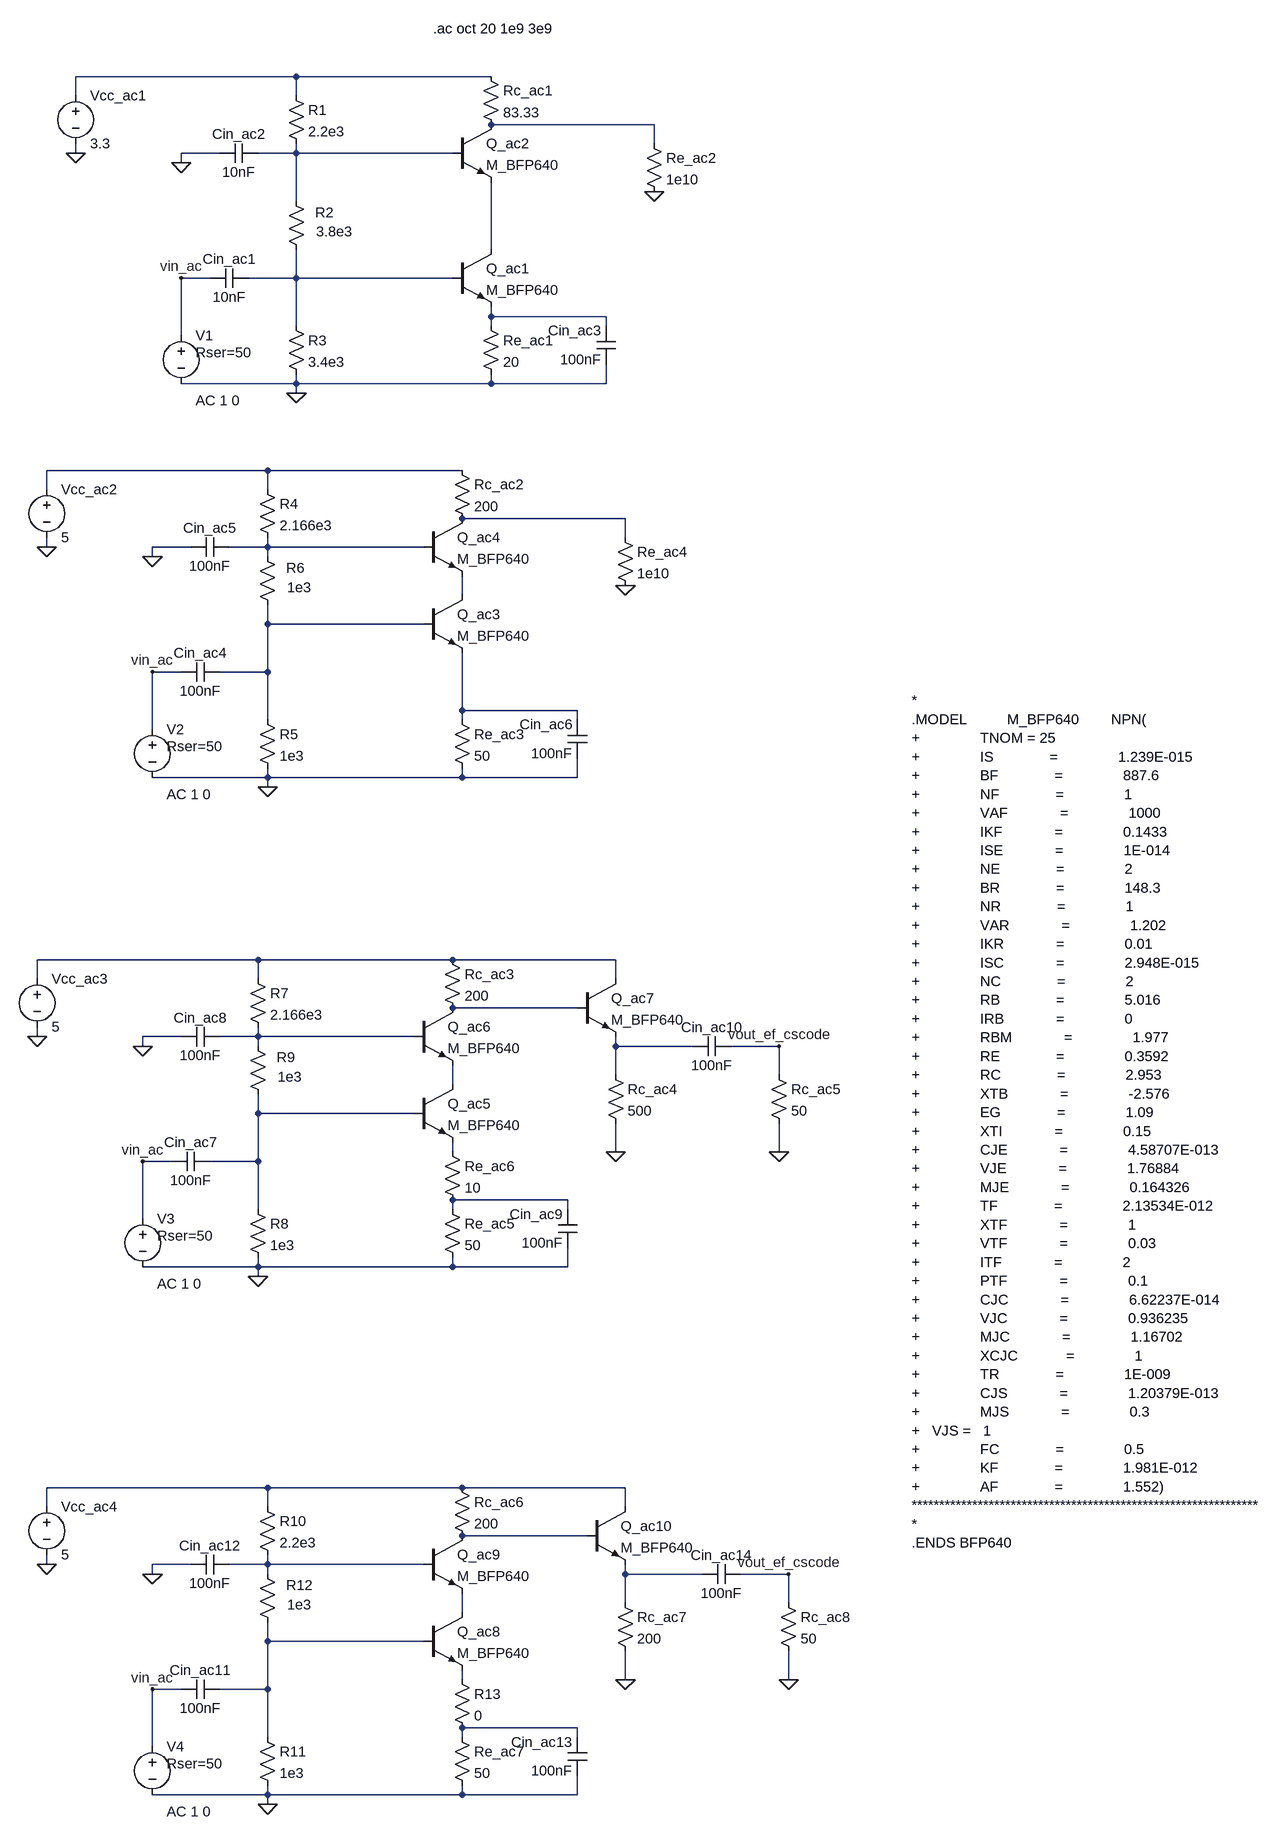
[diagram p0: schematic BP640_CASCODE_FREQ.asc]
BP640_CASCODE_FREQ.asc, the LTspice schematic file:
Version 4
SHEET 1 3460 2860
WIRE -288 -192 -656 -192
WIRE 48 -192 -288 -192
WIRE -656 -160 -656 -192
WIRE -288 -160 -288 -192
WIRE 320 -112 48 -112
WIRE 320 -80 320 -112
WIRE -656 -64 -656 -80
WIRE -416 -64 -480 -64
WIRE -288 -64 -288 -80
WIRE -288 -64 -352 -64
WIRE -16 -64 -288 -64
WIRE -480 -48 -480 -64
WIRE -288 16 -288 -64
WIRE 48 96 48 -16
WIRE -432 144 -480 144
WIRE -288 144 -288 96
WIRE -288 144 -368 144
WIRE -16 144 -288 144
WIRE 48 208 48 192
WIRE 240 208 48 208
WIRE -288 224 -288 144
WIRE 48 224 48 208
WIRE 240 224 240 208
WIRE -480 240 -480 144
WIRE -288 320 -288 304
WIRE -288 320 -480 320
WIRE 48 320 48 304
WIRE 48 320 -288 320
WIRE 240 320 240 288
WIRE 240 320 48 320
WIRE -288 336 -288 320
WIRE -336 608 -704 608
WIRE 0 608 -336 608
WIRE -704 640 -704 608
WIRE -336 640 -336 608
WIRE 272 688 0 688
WIRE 272 720 272 688
WIRE -704 736 -704 720
WIRE -464 736 -528 736
WIRE -336 736 -336 720
WIRE -336 736 -400 736
WIRE -64 736 -336 736
WIRE -528 752 -528 736
WIRE -336 752 -336 736
WIRE 0 816 0 784
WIRE -336 864 -336 832
WIRE -64 864 -336 864
WIRE -480 944 -528 944
WIRE -336 944 -336 864
WIRE -336 944 -416 944
WIRE 0 1008 0 912
WIRE 192 1008 0 1008
WIRE -336 1024 -336 944
WIRE 0 1024 0 1008
WIRE 192 1024 192 1008
WIRE -528 1040 -528 944
WIRE -336 1120 -336 1104
WIRE -336 1120 -528 1120
WIRE 0 1120 0 1104
WIRE 0 1120 -336 1120
WIRE 192 1120 192 1088
WIRE 192 1120 0 1120
WIRE -336 1136 -336 1120
WIRE -352 1424 -720 1424
WIRE -16 1424 -352 1424
WIRE 256 1424 -16 1424
WIRE -720 1456 -720 1424
WIRE -352 1456 -352 1424
WIRE 256 1456 256 1424
WIRE 192 1504 -16 1504
WIRE -720 1552 -720 1536
WIRE -480 1552 -544 1552
WIRE -352 1552 -352 1536
WIRE -352 1552 -416 1552
WIRE -80 1552 -352 1552
WIRE -544 1568 -544 1552
WIRE -352 1568 -352 1552
WIRE 256 1568 256 1552
WIRE 384 1568 256 1568
WIRE 528 1568 448 1568
WIRE 256 1616 256 1568
WIRE 528 1616 528 1568
WIRE -16 1632 -16 1600
WIRE -352 1680 -352 1648
WIRE -80 1680 -352 1680
WIRE -16 1744 -16 1728
WIRE 256 1744 256 1696
WIRE 528 1744 528 1696
WIRE -496 1760 -544 1760
WIRE -352 1760 -352 1680
WIRE -352 1760 -432 1760
WIRE 176 1824 -16 1824
WIRE -352 1840 -352 1760
WIRE -16 1840 -16 1824
WIRE 176 1840 176 1824
WIRE -544 1856 -544 1760
WIRE -352 1936 -352 1920
WIRE -352 1936 -544 1936
WIRE -16 1936 -16 1920
WIRE -16 1936 -352 1936
WIRE 176 1936 176 1904
WIRE 176 1936 -16 1936
WIRE -352 1952 -352 1936
WIRE -336 2304 -704 2304
WIRE 0 2304 -336 2304
WIRE 272 2304 0 2304
WIRE -704 2336 -704 2304
WIRE -336 2336 -336 2304
WIRE 272 2336 272 2304
WIRE 208 2384 0 2384
WIRE -704 2432 -704 2416
WIRE -464 2432 -528 2432
WIRE -336 2432 -336 2416
WIRE -336 2432 -400 2432
WIRE -64 2432 -336 2432
WIRE -528 2448 -528 2432
WIRE -336 2448 -336 2432
WIRE 272 2448 272 2432
WIRE 400 2448 272 2448
WIRE 544 2448 464 2448
WIRE 272 2496 272 2448
WIRE 544 2496 544 2448
WIRE 0 2512 0 2480
WIRE -336 2560 -336 2528
WIRE -64 2560 -336 2560
WIRE 0 2624 0 2608
WIRE 272 2624 272 2576
WIRE 544 2624 544 2576
WIRE -480 2640 -528 2640
WIRE -336 2640 -336 2560
WIRE -336 2640 -416 2640
WIRE 192 2704 0 2704
WIRE -336 2720 -336 2640
WIRE 0 2720 0 2704
WIRE 192 2720 192 2704
WIRE -528 2736 -528 2640
WIRE -336 2816 -336 2800
WIRE -336 2816 -528 2816
WIRE 0 2816 0 2800
WIRE 0 2816 -336 2816
WIRE 192 2816 192 2784
WIRE 192 2816 0 2816
WIRE -336 2832 -336 2816
FLAG -656 -64 0
FLAG -288 336 0
FLAG -480 144 vin_ac
FLAG 320 0 0
FLAG -480 -48 0
FLAG -704 736 0
FLAG -336 1136 0
FLAG -528 944 vin_ac
FLAG 272 800 0
FLAG -528 752 0
FLAG -720 1552 0
FLAG -352 1952 0
FLAG -544 1760 vin_ac
FLAG -544 1568 0
FLAG 256 1744 0
FLAG 528 1744 0
FLAG 528 1568 vout_ef_cscode
FLAG -704 2432 0
FLAG -336 2832 0
FLAG -528 2640 vin_ac
FLAG -528 2448 0
FLAG 272 2624 0
FLAG 544 2624 0
FLAG 544 2448 vout_ef_cscode
SYMBOL voltage -480 224 R0
WINDOW 123 24 124 Left 2
WINDOW 39 24 44 Left 2
SYMATTR Value2 AC 1 0
SYMATTR SpiceLine Rser=50
SYMATTR InstName V1
SYMATTR Value ""
SYMBOL voltage -656 -176 R0
WINDOW 123 0 0 Left 0
WINDOW 39 0 0 Left 0
SYMATTR InstName Vcc_ac1
SYMATTR Value 3.3
SYMBOL npn -16 96 R0
SYMATTR InstName Q_ac1
SYMATTR Value M_BFP640
SYMBOL res -304 -176 R0
SYMATTR InstName R1
SYMATTR Value 2.2e3
SYMBOL res -304 208 R0
SYMATTR InstName R3
SYMATTR Value 3.4e3
SYMBOL res 32 208 R0
SYMATTR InstName Re_ac1
SYMATTR Value 20
SYMBOL res 32 -208 R0
SYMATTR InstName Rc_ac1
SYMATTR Value 83.33
SYMBOL cap -368 128 R90
WINDOW 0 0 32 VBottom 2
WINDOW 3 32 32 VTop 2
SYMATTR InstName Cin_ac1
SYMATTR Value 10nF
SYMBOL res -304 0 R0
WINDOW 0 47 35 Left 2
WINDOW 3 49 67 Left 2
SYMATTR InstName R2
SYMATTR Value 3.8e3
SYMBOL npn -16 -112 R0
SYMATTR InstName Q_ac2
SYMATTR Value M_BFP640
SYMBOL res 304 -96 R0
SYMATTR InstName Re_ac2
SYMATTR Value 1e10
SYMBOL cap -352 -80 R90
WINDOW 0 0 32 VBottom 2
WINDOW 3 32 32 VTop 2
SYMATTR InstName Cin_ac2
SYMATTR Value 10nF
SYMBOL cap 256 288 R180
WINDOW 0 24 56 Left 2
WINDOW 3 24 8 Left 2
SYMATTR InstName Cin_ac3
SYMATTR Value 100nF
SYMBOL voltage -528 1024 R0
WINDOW 123 24 124 Left 2
WINDOW 39 24 44 Left 2
SYMATTR Value2 AC 1 0
SYMATTR SpiceLine Rser=50
SYMATTR InstName V2
SYMATTR Value ""
SYMBOL voltage -704 624 R0
WINDOW 123 0 0 Left 0
WINDOW 39 0 0 Left 0
SYMATTR InstName Vcc_ac2
SYMATTR Value 5
SYMBOL npn -64 816 R0
SYMATTR InstName Q_ac3
SYMATTR Value M_BFP640
SYMBOL res -352 624 R0
SYMATTR InstName R4
SYMATTR Value 2.166e3
SYMBOL res -352 1008 R0
SYMATTR InstName R5
SYMATTR Value 1e3
SYMBOL res -16 1008 R0
SYMATTR InstName Re_ac3
SYMATTR Value 50
SYMBOL res -16 592 R0
SYMATTR InstName Rc_ac2
SYMATTR Value 200
SYMBOL cap -416 928 R90
WINDOW 0 0 32 VBottom 2
WINDOW 3 32 32 VTop 2
SYMATTR InstName Cin_ac4
SYMATTR Value 100nF
SYMBOL res -352 736 R0
WINDOW 0 47 35 Left 2
WINDOW 3 49 67 Left 2
SYMATTR InstName R6
SYMATTR Value 1e3
SYMBOL npn -64 688 R0
SYMATTR InstName Q_ac4
SYMATTR Value M_BFP640
SYMBOL res 256 704 R0
SYMATTR InstName Re_ac4
SYMATTR Value 1e10
SYMBOL cap -400 720 R90
WINDOW 0 0 32 VBottom 2
WINDOW 3 32 32 VTop 2
SYMATTR InstName Cin_ac5
SYMATTR Value 100nF
SYMBOL cap 208 1088 R180
WINDOW 0 24 56 Left 2
WINDOW 3 24 8 Left 2
SYMATTR InstName Cin_ac6
SYMATTR Value 100nF
SYMBOL voltage -544 1840 R0
WINDOW 123 24 124 Left 2
WINDOW 39 24 44 Left 2
SYMATTR Value2 AC 1 0
SYMATTR SpiceLine Rser=50
SYMATTR InstName V3
SYMATTR Value ""
SYMBOL voltage -720 1440 R0
WINDOW 123 0 0 Left 0
WINDOW 39 0 0 Left 0
SYMATTR InstName Vcc_ac3
SYMATTR Value 5
SYMBOL npn -80 1632 R0
SYMATTR InstName Q_ac5
SYMATTR Value M_BFP640
SYMBOL res -368 1440 R0
SYMATTR InstName R7
SYMATTR Value 2.166e3
SYMBOL res -368 1824 R0
SYMATTR InstName R8
SYMATTR Value 1e3
SYMBOL res -32 1824 R0
SYMATTR InstName Re_ac5
SYMATTR Value 50
SYMBOL res -32 1408 R0
SYMATTR InstName Rc_ac3
SYMATTR Value 200
SYMBOL cap -432 1744 R90
WINDOW 0 0 32 VBottom 2
WINDOW 3 32 32 VTop 2
SYMATTR InstName Cin_ac7
SYMATTR Value 100nF
SYMBOL res -368 1552 R0
WINDOW 0 47 35 Left 2
WINDOW 3 49 67 Left 2
SYMATTR InstName R9
SYMATTR Value 1e3
SYMBOL npn -80 1504 R0
SYMATTR InstName Q_ac6
SYMATTR Value M_BFP640
SYMBOL cap -416 1536 R90
WINDOW 0 0 32 VBottom 2
WINDOW 3 32 32 VTop 2
SYMATTR InstName Cin_ac8
SYMATTR Value 100nF
SYMBOL cap 192 1904 R180
WINDOW 0 24 56 Left 2
WINDOW 3 24 8 Left 2
SYMATTR InstName Cin_ac9
SYMATTR Value 100nF
SYMBOL npn 192 1456 R0
SYMATTR InstName Q_ac7
SYMATTR Value M_BFP640
SYMBOL res 240 1600 R0
SYMATTR InstName Rc_ac4
SYMATTR Value 500
SYMBOL cap 448 1552 R90
WINDOW 0 0 32 VBottom 2
WINDOW 3 32 32 VTop 2
SYMATTR InstName Cin_ac10
SYMATTR Value 100nF
SYMBOL res 512 1600 R0
SYMATTR InstName Rc_ac5
SYMATTR Value 50
SYMBOL res -32 1728 R0
SYMATTR InstName Re_ac6
SYMATTR Value 10
SYMBOL voltage -528 2720 R0
WINDOW 123 24 124 Left 2
WINDOW 39 24 44 Left 2
SYMATTR Value2 AC 1 0
SYMATTR SpiceLine Rser=50
SYMATTR InstName V4
SYMATTR Value ""
SYMBOL voltage -704 2320 R0
WINDOW 123 0 0 Left 0
WINDOW 39 0 0 Left 0
SYMATTR InstName Vcc_ac4
SYMATTR Value 5
SYMBOL npn -64 2512 R0
SYMATTR InstName Q_ac8
SYMATTR Value M_BFP640
SYMBOL res -352 2320 R0
SYMATTR InstName R10
SYMATTR Value 2.2e3
SYMBOL res -352 2704 R0
SYMATTR InstName R11
SYMATTR Value 1e3
SYMBOL res -16 2704 R0
SYMATTR InstName Re_ac7
SYMATTR Value 50
SYMBOL res -16 2288 R0
SYMATTR InstName Rc_ac6
SYMATTR Value 200
SYMBOL cap -416 2624 R90
WINDOW 0 0 32 VBottom 2
WINDOW 3 32 32 VTop 2
SYMATTR InstName Cin_ac11
SYMATTR Value 100nF
SYMBOL res -352 2432 R0
WINDOW 0 47 35 Left 2
WINDOW 3 49 67 Left 2
SYMATTR InstName R12
SYMATTR Value 1e3
SYMBOL npn -64 2384 R0
SYMATTR InstName Q_ac9
SYMATTR Value M_BFP640
SYMBOL cap -400 2416 R90
WINDOW 0 0 32 VBottom 2
WINDOW 3 32 32 VTop 2
SYMATTR InstName Cin_ac12
SYMATTR Value 100nF
SYMBOL cap 208 2784 R180
WINDOW 0 24 56 Left 2
WINDOW 3 24 8 Left 2
SYMATTR InstName Cin_ac13
SYMATTR Value 100nF
SYMBOL npn 208 2336 R0
SYMATTR InstName Q_ac10
SYMATTR Value M_BFP640
SYMBOL res 256 2480 R0
SYMATTR InstName Rc_ac7
SYMATTR Value 200
SYMBOL cap 464 2432 R90
WINDOW 0 0 32 VBottom 2
WINDOW 3 32 32 VTop 2
SYMATTR InstName Cin_ac14
SYMATTR Value 100nF
SYMBOL res 528 2480 R0
SYMATTR InstName Rc_ac8
SYMATTR Value 50
SYMBOL res -16 2608 R0
SYMATTR InstName R13
SYMATTR Value 0
TEXT -48 -272 Left 2 !.ac oct 20 1e9 3e9
TEXT 2536 992 Left 2 !*\n.MODEL          M_BFP640        NPN(\n+               TNOM = 25\n+               IS              =               1.239E-015\n+               BF              =               887.6\n+               NF              =               1\n+               VAF             =               1000\n+               IKF             =               0.1433\n+               ISE             =               1E-014\n+               NE              =               2\n+               BR              =               148.3\n+               NR              =               1\n+               VAR             =               1.202\n+               IKR             =               0.01\n+               ISC             =               2.948E-015\n+               NC              =               2\n+               RB              =               5.016\n+               IRB             =               0\n+               RBM             =               1.977\n+               RE              =               0.3592\n+               RC              =               2.953\n+               XTB             =               -2.576\n+               EG              =               1.09\n+               XTI             =               0.15\n+               CJE             =               4.58707E-013\n+               VJE             =               1.76884\n+               MJE             =               0.164326\n+               TF              =               2.13534E-012\n+               XTF             =               1\n+               VTF             =               0.03\n+               ITF             =               2\n+               PTF             =               0.1\n+               CJC             =               6.62237E-014\n+               VJC             =               0.936235\n+               MJC             =               1.16702\n+               XCJC            =               1\n+               TR              =               1E-009\n+               CJS             =               1.20379E-013\n+               MJS             =               0.3\n+   VJS =   1\n+               FC              =               0.5\n+               KF              =               1.981E-012\n+               AF              =               1.552)\n***************************************************************\n*\n.ENDS BFP640

The netlist it stands for:
* BP640_CASCODE_FREQ.asc
V1 vin_ac 0 AC 1 0 Rser=50
Vcc_ac1 N001 0 3.3
Q_ac1 N004 N005 N006 0 M_BFP640
R1 N001 N003 2.2e3
R3 N005 0 3.4e3
Re_ac1 N006 0 20
Rc_ac1 N001 N002 83.33
Cin_ac1 N005 vin_ac 10nF
R2 N003 N005 3.8e3
Q_ac2 N002 N003 N004 0 M_BFP640
Re_ac2 N002 0 1e10
Cin_ac2 N003 0 10nF
Cin_ac3 0 N006 100nF
V2 vin_ac 0 AC 1 0 Rser=50
Vcc_ac2 N007 0 5
Q_ac3 N010 N011 N012 0 M_BFP640
R4 N007 N009 2.166e3
R5 N011 0 1e3
Re_ac3 N012 0 50
Rc_ac2 N007 N008 200
Cin_ac4 N011 vin_ac 100nF
R6 N009 N011 1e3
Q_ac4 N008 N009 N010 0 M_BFP640
Re_ac4 N008 0 1e10
Cin_ac5 N009 0 100nF
Cin_ac6 0 N012 100nF
V3 vin_ac 0 AC 1 0 Rser=50
Vcc_ac3 N013 0 5
Q_ac5 N017 N018 N019 0 M_BFP640
R7 N013 N015 2.166e3
R8 N018 0 1e3
Re_ac5 N020 0 50
Rc_ac3 N013 N014 200
Cin_ac7 N018 vin_ac 100nF
R9 N015 N018 1e3
Q_ac6 N014 N015 N017 0 M_BFP640
Cin_ac8 N015 0 100nF
Cin_ac9 0 N020 100nF
Q_ac7 N013 N014 N016 0 M_BFP640
Rc_ac4 N016 0 500
Cin_ac10 vout_ef_cscode N016 100nF
Rc_ac5 vout_ef_cscode 0 50
Re_ac6 N019 N020 10
V4 vin_ac 0 AC 1 0 Rser=50
Vcc_ac4 N021 0 5
Q_ac8 N025 N026 N027 0 M_BFP640
R10 N021 N023 2.2e3
R11 N026 0 1e3
Re_ac7 N028 0 50
Rc_ac6 N021 N022 200
Cin_ac11 N026 vin_ac 100nF
R12 N023 N026 1e3
Q_ac9 N022 N023 N025 0 M_BFP640
Cin_ac12 N023 0 100nF
Cin_ac13 0 N028 100nF
Q_ac10 N021 N022 N024 0 M_BFP640
Rc_ac7 N024 0 200
Cin_ac14 vout_ef_cscode N024 100nF
Rc_ac8 vout_ef_cscode 0 50
R13 N027 N028 0
.model NPN NPN
.model PNP PNP
.lib standard.bjt
.ac oct 20 1e9 3e9
*
.MODEL          M_BFP640        NPN(
+               TNOM = 25
+               IS              =               1.239E-015
+               BF              =               887.6
+               NF              =               1
+               VAF             =               1000
+               IKF             =               0.1433
+               ISE             =               1E-014
+               NE              =               2
+               BR              =               148.3
+               NR              =               1
+               VAR             =               1.202
+               IKR             =               0.01
+               ISC             =               2.948E-015
+               NC              =               2
+               RB              =               5.016
+               IRB             =               0
+               RBM             =               1.977
+               RE              =               0.3592
+               RC              =               2.953
+               XTB             =               -2.576
+               EG              =               1.09
+               XTI             =               0.15
+               CJE             =               4.58707E-013
+               VJE             =               1.76884
+               MJE             =               0.164326
+               TF              =               2.13534E-012
+               XTF             =               1
+               VTF             =               0.03
+               ITF             =               2
+               PTF             =               0.1
+               CJC             =               6.62237E-014
+               VJC             =               0.936235
+               MJC             =               1.16702
+               XCJC            =               1
+               TR              =               1E-009
+               CJS             =               1.20379E-013
+               MJS             =               0.3
+   VJS =   1
+               FC              =               0.5
+               KF              =               1.981E-012
+               AF              =               1.552)
***************************************************************
*
.ENDS BFP640
.backanno
.end